# EasyEDA schematic RGB-Controller.json
TITLE: 12v RGB WiFi Controller; REV: 0.4; Date: 2022-04-02; Sheet: 1/1; Drawn By: Sneer; Company: Zarus Labs
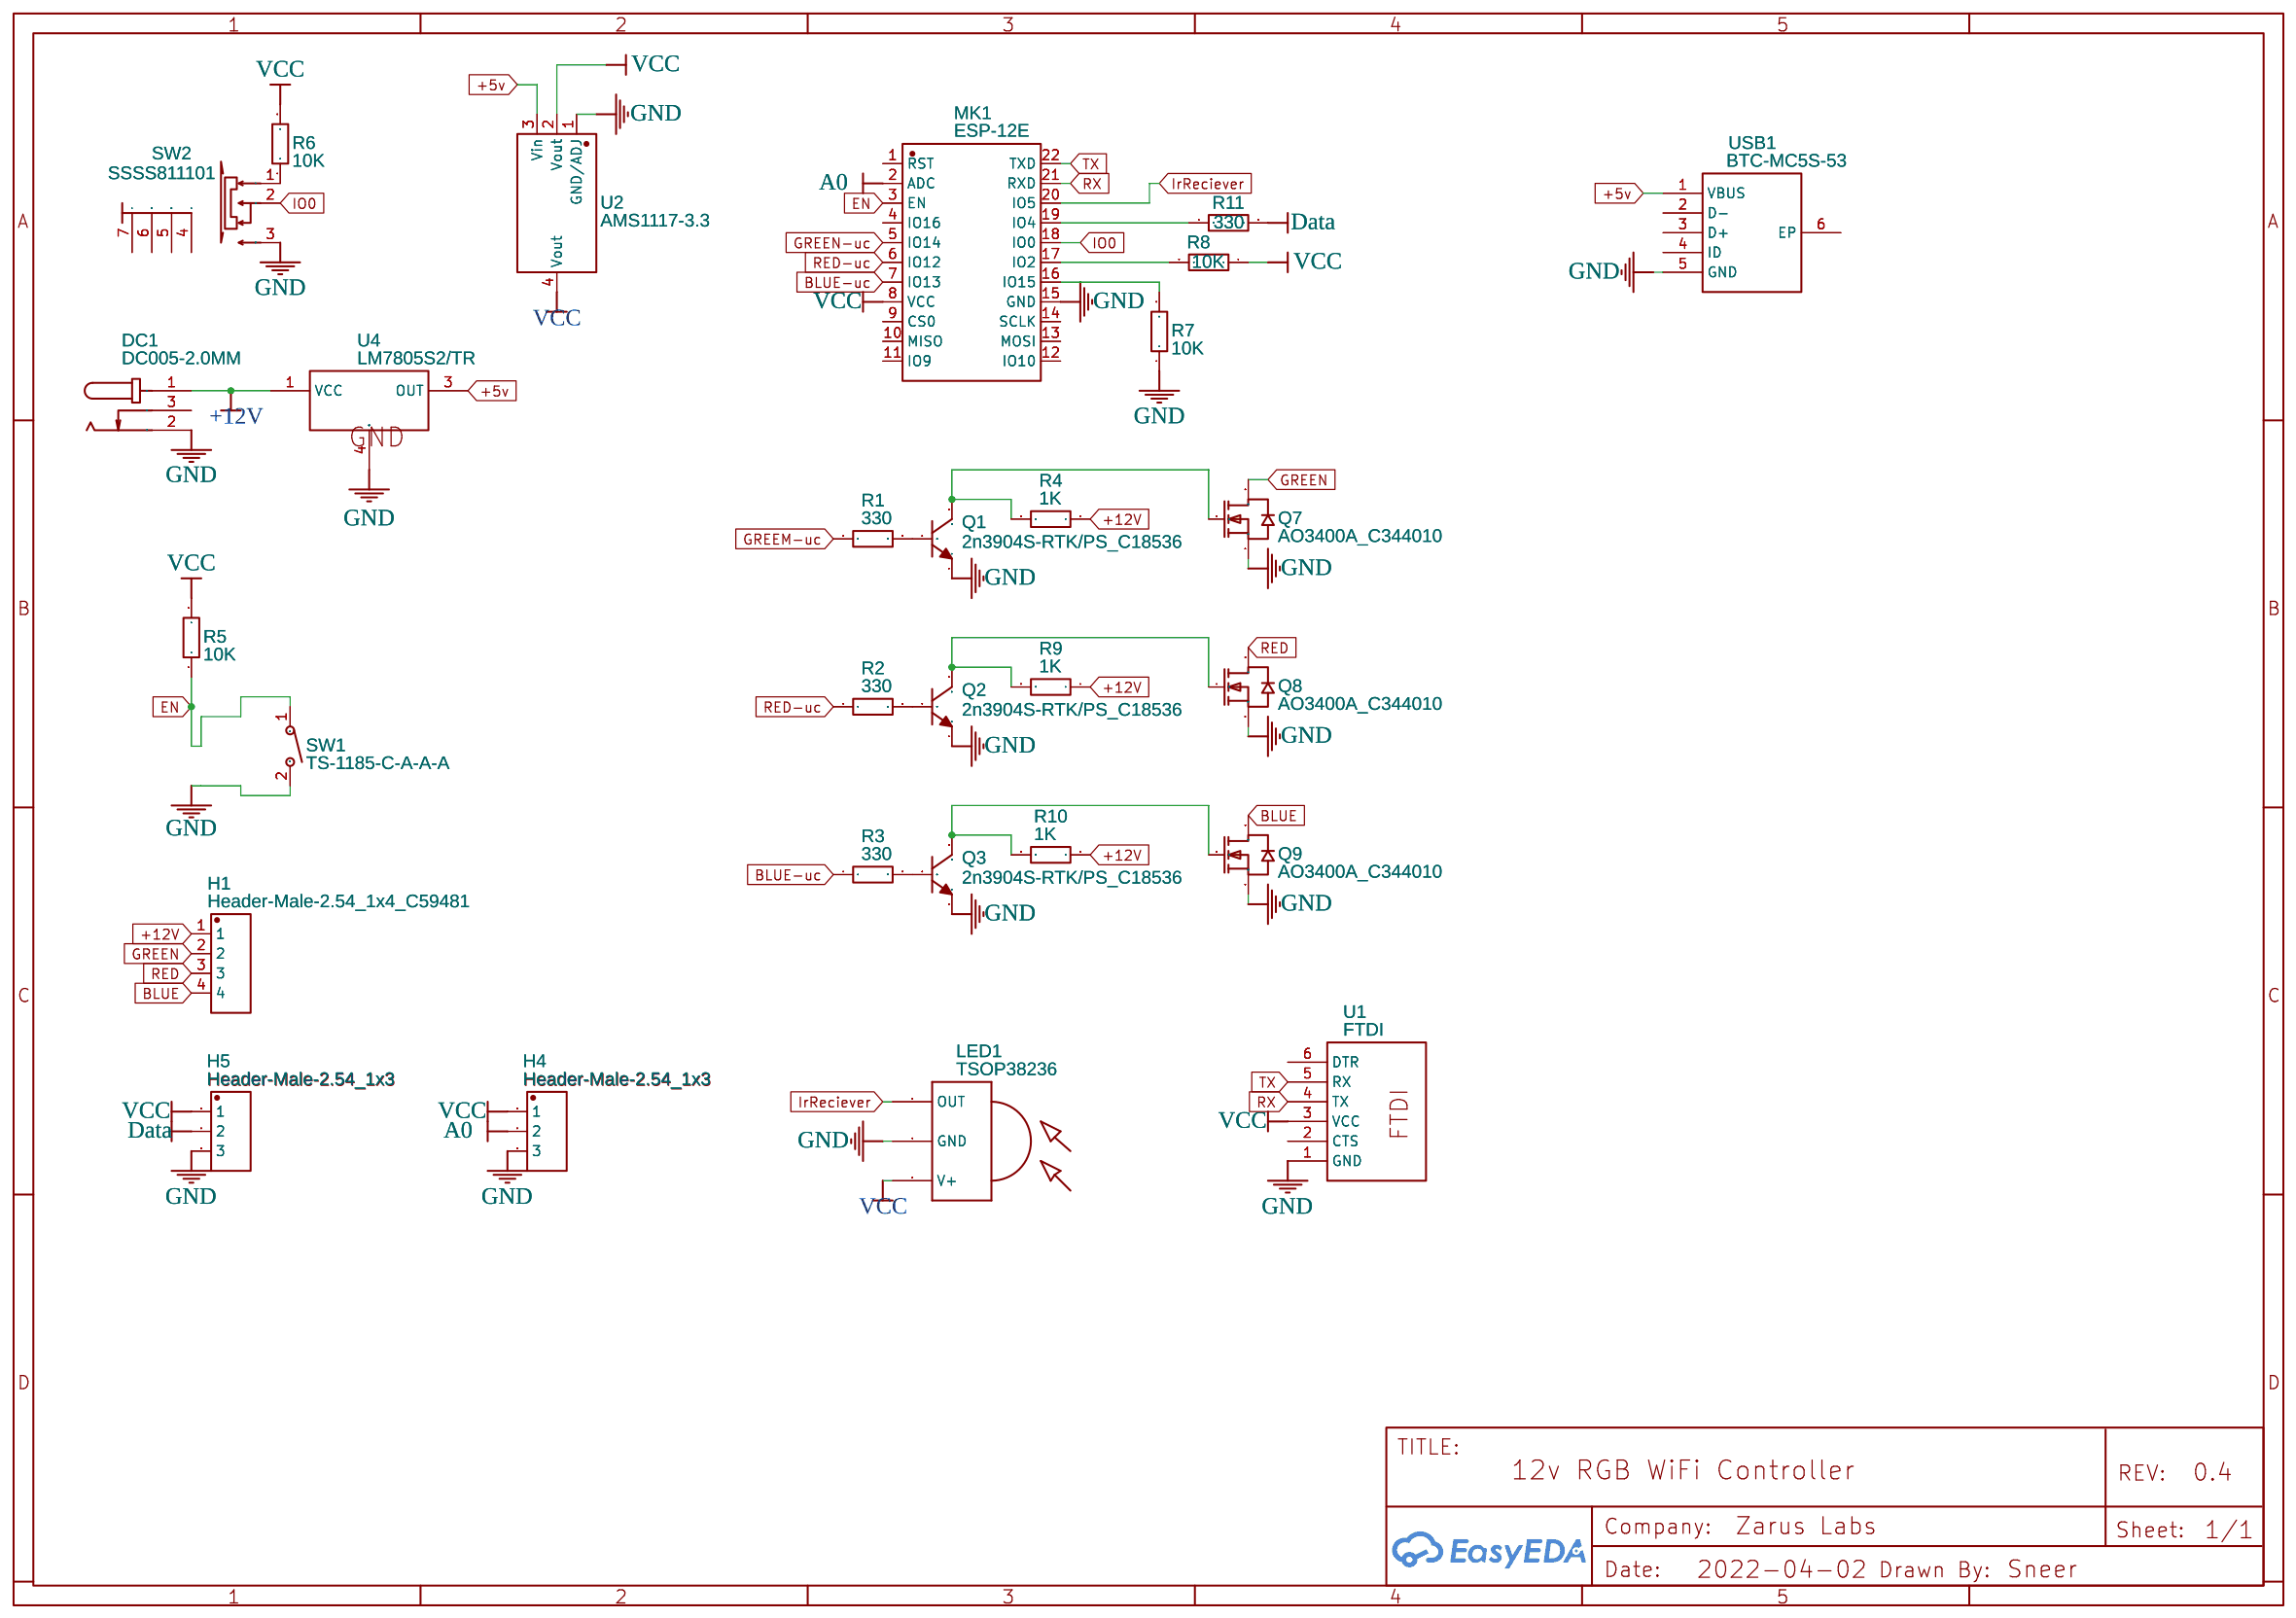
[diagram p0: schematic sheet]

## Parts
DC1  DC005-2.0MM  [DC-IN-TH_DC005]
H1  Header-Male-2.54_1x4_C59481  [HDR-TH_4P-P2.54-V]
H4  Header-Male-2.54_1x3  [HEADER-MALE-2.54_1X3]
H5  Header-Male-2.54_1x3  [HEADER-MALE-2.54_1X3]
LED1  TSOP38236  [SENSOR-TG_TSOP38236]
MK1  ESP-12E  [WIFIM-SMD_ESP-12E]
Q1  2n3904S-RTK/PS_C18536  [SOT-23-3_L2.9-W1.3-P1.90-LS2.4-TR]
Q2  2n3904S-RTK/PS_C18536  [SOT-23-3_L2.9-W1.3-P1.90-LS2.4-TR]
Q3  2n3904S-RTK/PS_C18536  [SOT-23-3_L2.9-W1.3-P1.90-LS2.4-TR]
Q7  AO3400A_C344010  [SOT-23_L2.9-W1.3-P1.90-LS2.4-BR]
Q8  AO3400A_C344010  [SOT-23_L2.9-W1.3-P1.90-LS2.4-BR]
Q9  AO3400A_C344010  [SOT-23_L2.9-W1.3-P1.90-LS2.4-BR]
R1  330  [R0805]
R2  330  [R0805]
R3  330  [R0805]
R4  1K  [R1210]
R5  10K  [R1206]
R6  10K  [R1206]
R7  10K  [R1206]
R8  10K  [R1206]
R9  1K  [R1210]
R10  1K  [R1210]
R11  330  [R0805]
SW1  TS-1185-C-A-A-A  [SW-SMD_L4.0-W3.0-LS5.0-EH]
SW2  SSSS811101  [SW-SMD_SSSS811101]
U1  FTDI  [FTDI_PROG]
U2  AMS1117-3.3  [SOT-223-3_L6.5-W3.4-P2.30-LS7.0-BR]
U4  LM7805S2/TR  [TO-263-2_L10.0-W9.1-P5.08-LS15.2-BL]
USB1  BTC-MC5S-53  [MICRO-USB-SMD_MICRO-USB-BTC-MC5S-43]

## Library data of the parts
DC1 = DC005-2.0MM: Supplier: LCSC; Manufacturer: SOFNG; Supplier Part: C111567
H1 = Header-Male-2.54_1x4_C59481: Supplier: LCSC; Manufacturer: ReliaPro; Manufacturer Part: Headers  Pins 1*4P; Supplier Part: C59481; Package Display: No
H4 H5 = Header-Male-2.54_1x3: Contributor: Destiny
LED1 = TSOP38236: Supplier: LCSC; Manufacturer: VISHAY; Supplier Part: C5139; JLCPCB Part Class: Extended Part; Package Display: No
MK1 = ESP-12E: Supplier: LCSC; Manufacturer: Ai-Thinker; Supplier Part: C89297; JLCPCB Part Class: Extended Part
Q1-Q3 = 2n3904S-RTK/PS_C18536: Supplier: LCSC; Manufacturer: KEC; Manufacturer Part: 2n3904S-RTK/PS; Supplier Part: C18536; JLCPCB Part Class: Extended Part
Q7-Q9 = AO3400A_C344010: Supplier: LCSC; Supplier Part: C344010; Manufacturer: Bourne Semicon (Shenzhen); Manufacturer Part: AO3400A; Contributor: LCSC; JLCPCB Part Class: Extended Part
R1-R3 R11 = 0805W8J0331T5E: Supplier: LCSC; Manufacturer: UniOhm; Supplier Part: C25306; JLCPCB Part Class: Extended Part
R4 R9 R10 = 1210W3J0102T5E: Supplier: LCSC; Manufacturer: UniOhm; Supplier Part: C25681; JLCPCB Part Class: Extended Part
R5-R8 = 1206W4F1002T5E: Supplier: LCSC; Manufacturer: UniOhm; Supplier Part: C17902; JLCPCB Part Class: Basic Part
SW1 = TS-1185-C-A-A-A: Supplier: LCSC; Supplier Part: C561518; Manufacturer: XKB Enterprise; Contributor: LCSC; JLCPCB Part Class: Extended Part
SW2 = SSSS811101: Supplier: LCSC; Manufacturer: ALPS; Supplier Part: C109335; JLCPCB Part Class: Extended Part
U1 = FTDI: Contributor: nematic.business; Package Display: No
U2 = AMS1117-3.3: sourceId: dwIGgezVh; Supplier: LCSC; Manufacturer: AMS; Supplier Part: C6186; JLCPCB Part Class: Basic Part
U4 = LM7805S2/TR: Supplier: LCSC; Supplier Part: C2902505; Manufacturer: HGSEMI(华冠); Contributor: LCSC; JLCPCB Part Class: Extended Part
USB1 = BTC-MC5S-53: Supplier: LCSC; Supplier Part: C2908216; Manufacturer: DGBZ(东莞博众); Contributor: LCSC

## Nets
+5v: U2.3(Vin) U4.3(OUT) USB1.1(VBUS)
+12V: DC1.1 H1.1 R4.1 R9.1 R10.1 U4.1(VCC)
GND: DC1.2 H4.3 H5.3 LED1.2(GND) MK1.15(GND) Q1.1(E) Q2.1(E) Q3.1(E) Q7.2(S) Q8.2(S) Q9.2(S) R7.1 SW1.2 SW2.3 U1.1(GND) U2.1(GND/ADJ) U4.4(GND) USB1.5(GND)
VCC: H4.1 H5.1 LED1.3(V+) MK1.8(VCC) R5.2 R6.2 R8.1 U1.3(VCC) U2.2(Vout) U2.4(Vout)
A0: H4.2 MK1.2(ADC)
BLUE: H1.4 Q9.3(D)
BLUE-uc: MK1.7(IO13) R3.1
Data: H5.2 R11.2
EN: MK1.3(EN) R5.1 SW1.1
GREEM-uc: R1.1
GREEN: H1.2 Q7.3(D)
GREEN-uc: MK1.5(IO14)
IO0: MK1.18(IO0) SW2.2
IrReciever: LED1.1(OUT) MK1.20(IO5)
RED: H1.3 Q8.3(D)
RED-uc: MK1.6(IO12) R2.1
RX: MK1.21(RXD) U1.4(TX)
TX: MK1.22(TXD) U1.5(RX)
Net-(MK1-16): MK1.16(IO15) R7.2
Net-(MK1-17): MK1.17(IO2) R8.2
Net-(MK1-19): MK1.19(IO4) R11.1
Net-(Q1-2): Q1.2(B) R1.2
Net-(Q1-3): Q1.3(C) Q7.1(G) R4.2
Net-(Q2-2): Q2.2(B) R2.2
Net-(Q2-3): Q2.3(C) Q8.1(G) R9.2
Net-(Q3-2): Q3.2(B) R3.2
Net-(Q3-3): Q3.3(C) Q9.1(G) R10.2
Net-(R6-1): R6.1 SW2.1

Not connected (* = marked no-connect by the designer): DC1 3; MK1 1(RST) 4(IO16) 9(CS0) 10(MISO) 11(IO9) 12(IO10) 13(MOSI) 14(SCLK); SW2 4 5 6 7; U1 2(CTS) 6(DTR); USB1 2(D-) 3(D+) 4(ID) 6(EP)
